# Altium schematic sheet PIN_Gamma_Power.SchDoc
size A
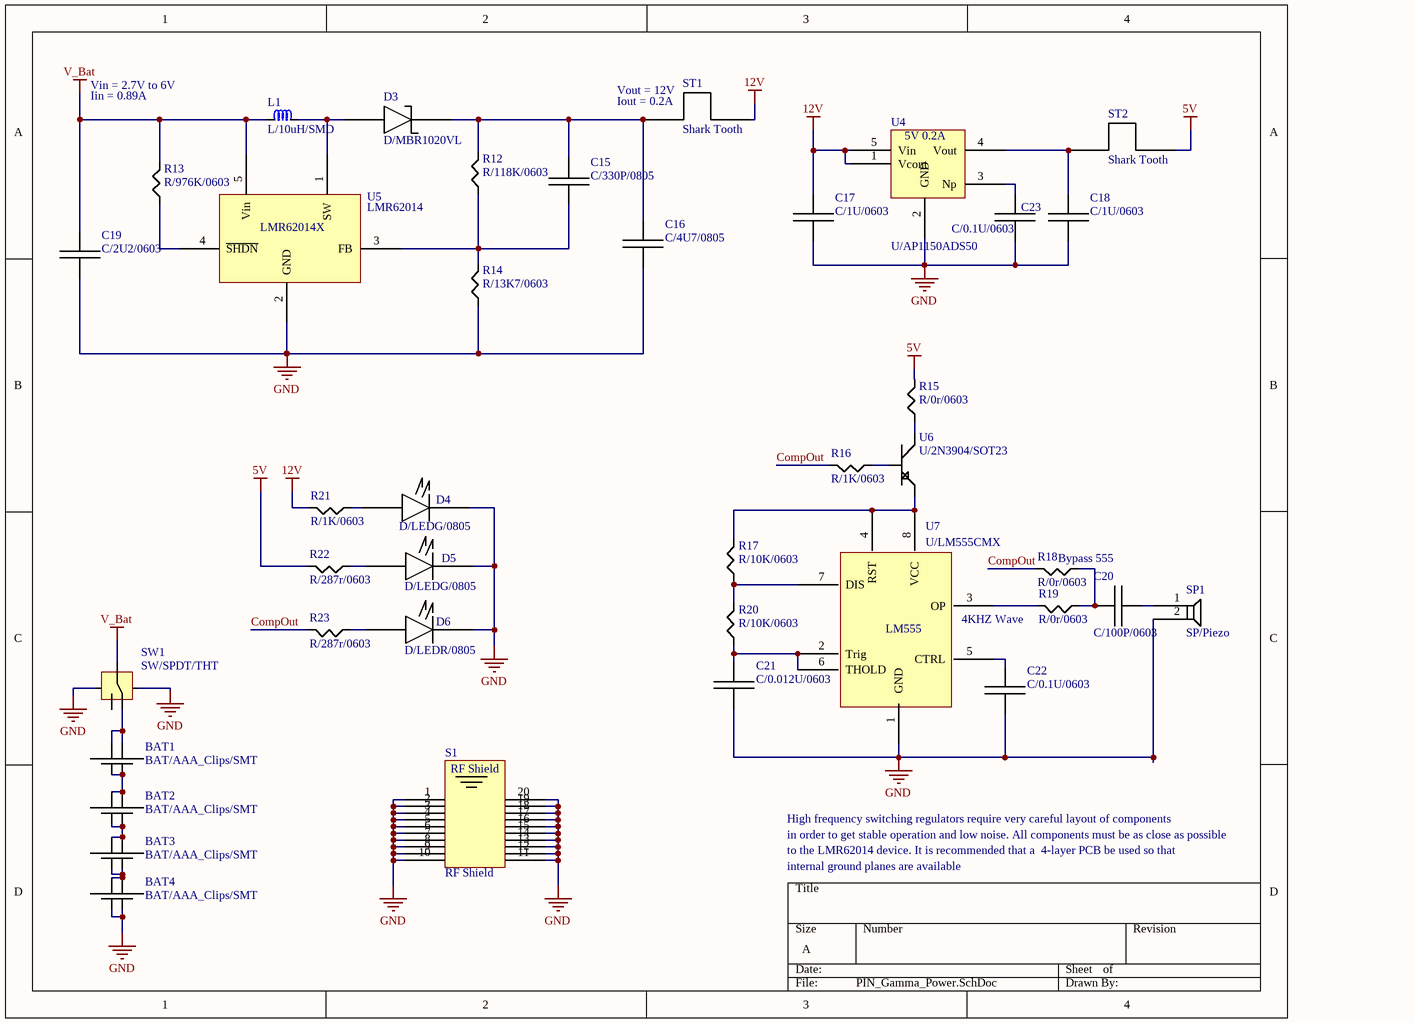
[diagram p0: PIN_Gamma_Power.SchDoc]

## Parts
BAT1  BAT/AAA_Clips/SMT  [AAA_Battery_SMT]
BAT2  BAT/AAA_Clips/SMT  [AAA_Battery_SMT]
BAT3  BAT/AAA_Clips/SMT  [AAA_Battery_SMT]
BAT4  BAT/AAA_Clips/SMT  [AAA_Battery_SMT]
C15  C/330P/0805  [C/0603]
C16  C/4U7/0805  [R/0805]
C17  C/1U/0603  [C/0603]
C18  C/1U/0603  [C/0603]
C19  C/2U2/0603  [C/0603]
C20  C/100P/0603  [C/0603]
C21  C/0.012U/0603  [C/0603]
C22  C/0.1U/0603  [C/0603]
C23  C/0.1U/0603  [C/0603]
D3  D/MBR1020VL  [SOD-123F]
D4  D/LEDG/0805  [D/0805]
D5  D/LEDG/0805  [D/0805]
D6  D/LEDR/0805  [D/0805]
L1  L/10uH/SMD  [INDP3030X15N]
R12  R/118K/0603  [R/0603]
R13  R/976K/0603  [R/0603]
R14  R/13K7/0603  [R/0603]
R15  R/0r/0603  [R/0603]
R16  R/1K/0603  [R/0603]
R17  R/10K/0603  [R/0603]
R18  R/0r/0603  [R/0603]
R19  R/0r/0603  [R/0603]
R20  R/10K/0603  [R/0603]
R21  R/1K/0603  [R/0603]
R22  R/287r/0603  [R/0603]
R23  R/287r/0603  [R/0603]
S1  RF Shield  [RF Shield]
SP1  SP/Piezo  [AUDIO PIEZO]
ST1  Shark Tooth  [SharkTooth]
ST2  Shark Tooth  [SharkTooth]
SW1  SW/SPDT/THT  [SW/SPDT/THT]
U4  U/AP1150ADS50  [SOT23-5]
U5  LMR62014  [SOT23-5]
U6  U/2N3904/SOT23  [SOT23-3]
U7  U/LM555CMX  [SO8]

## Nets
5V: R15.1 R22.1 ST2.2
12V: C17.1 R21.1 ST1.2 U4.1(Vcont) U4.5(Vin)
GND: BAT4.3 BAT4.4 C16.2 C17.2 C18.2 C19.2 C21.2 C22.2 C23.2 D4.1 D5.1 D6.1 R14.2 S1.1(GND1) S1.2(GND2) S1.3(GND3) S1.4(GND4) S1.5(GND5) S1.6(GND6) S1.7(GND7) S1.8(GND8) S1.9(GND9) S1.10(GND10) S1.11(GND11) S1.12(GND12) S1.13(GND13) S1.14(GND14) S1.15(GND15) S1.16(GND16) S1.17(GND17) S1.18(GND18) S1.19(GND19) S1.20(GND20) SP1.2 SW1.1(GND) SW1.5(GND) U4.2(GND) U5.2(GND) U7.1(GND)
V_Bat: C19.1 L1.2 R13.1 SW1.3(COM) U5.5(Vin)
CompOut: R16.1 R18.1 R23.1
NetBAT1_1: BAT1.1 BAT1.2 SW1.4(B)
NetBAT1_3: BAT1.3 BAT1.4 BAT2.1 BAT2.2
NetBAT2_3: BAT2.3 BAT2.4 BAT3.1 BAT3.2
NetBAT3_3: BAT3.3 BAT3.4 BAT4.1 BAT4.2
NetC15_1: C15.1 R12.2 R14.1 U5.3(FB)
NetC15_2: C15.2 C16.1 D3.1 R12.1 ST1.1
NetC18_1: C18.1 ST2.1 U4.4(Vout)
NetC20_1: C20.1 R18.2 R19.2
NetC20_2: C20.2 SP1.1
NetC21_1: C21.1 R20.2 U7.2(Trig) U7.6(THOLD)
NetC22_1: C22.1 U7.5(CTRL)
NetC23_1: C23.1 U4.3(Np)
NetD3_2: D3.2 L1.1 U5.1(SW)
NetD4_2: D4.2 R21.2
NetD5_2: D5.2 R22.2
NetD6_2: D6.2 R23.2
NetR13_2: R13.2 U5.4(~{SHDN})
NetR15_2: R15.2 U6.3(Collector)
NetR16_2: R16.2 U6.1(Base)
NetR17_1: R17.1 U6.2(Emitter) U7.4(RST) U7.8(VCC)
NetR17_2: R17.2 R20.1 U7.7(DIS)
NetR19_1: R19.1 U7.3(OP)

Not connected (* = marked no-connect by the designer): SW1 2(A)

## Notes on the sheet
- Vin = 2.7V to 6V
- Iin = 0.89A
- (near ST1) Vout = 12V
- (near ST1) Iout = 0.2A
- (near R18) Bypass 555
- (near U7) 4KHZ Wave
- High frequency switching regulators require very careful layout of components
- in order to get stable operation and low noise. All components must be as close as possible
- to the LMR62014 device. It is recommended that a  4-layer PCB be used so that
- internal ground planes are available
- (in symbol U/AP1150ADS50) 5V 0.2A
- (in symbol U/LM555CMX) LM555
- (in symbol U/LMR62014XMF/NOPBCT-ND) LMR62014X

## Library data of the parts
BAT1-BAT4 = BAT/AAA_Clips/SMT: AAA 1.5V SMT Clips; Digikey Part: 36-55-ND
C15 = C/330P/0805: CAP CER 330PF 50V C0G/NP0 0805; Digikey: 1276-2645-1-ND
C16 = C/4U7/0805: CAP CER 4.7UF 50V X5R 0805; Digikey: 1276-1860-1-ND
C17 C18 = C/1U/0603: CAP CER 1UF 50V X5R 0603; Digikey: 1276-1860-1-ND
C19 = C/2U2/0603: 2.2µF ±10% 10V Ceramic Capacitor X5R 0603 (1608 Metric); Digikey: 490-1545-1-ND
C20 = C/100P/0603: CAP CER 100PF 50V C0G/NP0 0603; Digikey: 399-1061-1-ND
C21 = C/0.012U/0603: CAP CER 0.012UF 50V X7R 0603; Digikey Part: 1276-1785-1-ND
C22 C23 = C/0.1U/0603: CAP CER 0.1UF 50V X7R 0603; Digikey Part: 399-7845-1-ND
D3 = D/MBR1020VL: Diode Schottky 20V 1A Surface Mount SOD-123F; Digikey Part: MBR1020VLCT-ND
D4 D5 = D/LEDG/0805: LED GREEN CLEAR 2.1V 0805 SMD; Digikey Part: 160-1423-1-ND
D6 = D/LEDR/0805: LED GREEN CLEAR 2V 0805 SMD; Digikey Part: 160-1427-1-ND
L1 = L/10uH/SMD: 10µH Semi-Shielded Wirewound Inductor 1A 276 mOhm Max Nonstandard; Digikey Part: SRN3015-100MCT-ND
R12 = R/118K/0603: RES SMD 118K OHM 1% 1/10W 0603; Digikey Part: 311-118KHRCT-ND
R13 = R/976K/0603: RES SMD 976K OHM 1% 1/10W 0603; Digikey Part: 311-976KHRCT-ND
R14 = R/13K7/0603: RES SMD 13.7K OHM 1% 1/10W 0603; Digikey Part: 311-13.7KHRCT-ND
R15 R18 R19 = R/0r/0603: RES SMD 0 OHM JUMPER 1/10W 0603; Digikey Part: 311-0.0GRCT-ND
R16 R21 = R/1K/0603: RES SMD 1K OHM 5% 1/10W 0603; Digikey Part: 311-1.0KGRCT-ND
R17 R20 = R/10K/0603: RES SMD 10K OHM 5% 1/10W 0603; Digikey Part: 311-10KGRCT-ND
R22 R23 = R/287r/0603: RES SMD 287 OHM 1% 1/10W 0603; Digikey Part: 311-287HRCT-ND
S1 = RF Shield: SMS-403C & SMS-403F RF Shield Cover 1.058" (26.87mm) X 1.058" (26.87mm) Non-Vented Surface Mount; Digikey PartF: 1798-1211-1-ND; Digikey PartC: 1798-1210-ND
SP1 = SP/Piezo: AUDIO PIEZO TRANSDUCER Max 12.5V 4KHZ SMD; Digikey Part: 490-9647-1-ND
ST1 ST2 = Shark Tooth: Sharks Tooth Small
SW1 = SW/SPDT/THT: SWITCH SLIDE SPDT 200MA 30V; Digikey Part: A107673-ND
U4 = U/AP1150ADS50: IC REG LINEAR 5V 200MA SOT23-5; Digikey Part: AP1150ADS50CT-ND
U5 = U/LMR62014XMF/NOPBCT-ND: Boost Switching Regulator IC Positive Adjustable 3V 1 Output 1.8A (Switch) SC-74A, SOT-753
U6 = U/2N3904/SOT23: TRANS NPN 40V 0.2A SOT23; Digikey Part: MMBT3904LT3GOSCT-ND
U7 = U/LM555CMX: 555 Type, Timer/Oscillator (Single) IC 8-SOIC